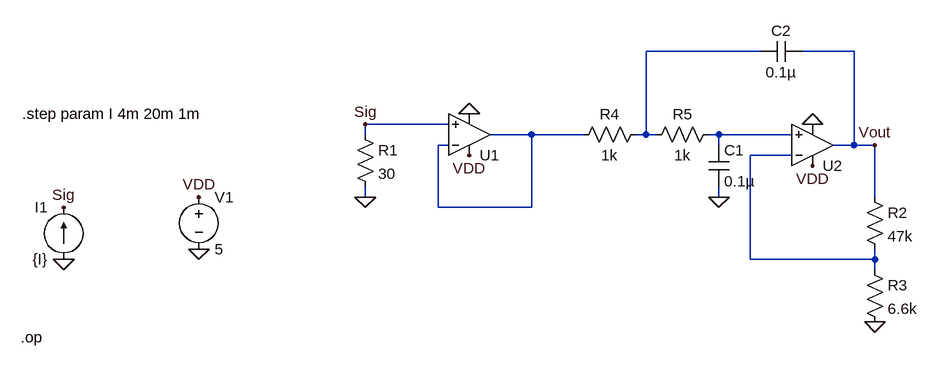
[diagram p0: schematic Pressure_Transducerasc.asc]
Pressure_Transducerasc.asc, the LTspice schematic file:
Version 4
SHEET 1 936 680
WIRE 688 -16 512 -16
WIRE 832 -16 752 -16
WIRE 208 96 80 96
WIRE 80 112 80 96
WIRE 336 112 272 112
WIRE 416 112 336 112
WIRE 512 112 512 -16
WIRE 512 112 496 112
WIRE 528 112 512 112
WIRE 624 112 608 112
WIRE 736 112 624 112
WIRE 208 128 192 128
WIRE 624 128 624 112
WIRE 832 128 832 -16
WIRE 832 128 800 128
WIRE 864 128 832 128
WIRE 736 144 672 144
WIRE 80 208 80 192
WIRE 624 208 624 192
WIRE 864 208 864 128
WIRE 192 224 192 128
WIRE 336 224 336 112
WIRE 336 224 192 224
WIRE 672 304 672 144
WIRE 864 304 864 288
WIRE 864 304 672 304
WIRE 864 320 864 304
FLAG 80 208 0
FLAG -176 288 0
FLAG -176 208 VDD
FLAG 240 144 VDD
FLAG 768 160 VDD
FLAG 240 80 0
FLAG 768 96 0
FLAG 864 400 0
FLAG 864 128 Vout
FLAG -384 304 0
FLAG -384 224 Sig
FLAG 80 96 Sig
FLAG 624 208 0
SYMBOL res 64 96 R0
SYMATTR InstName R1
SYMATTR Value 30
SYMBOL OpAmps\\UniversalOpAmp2 240 112 M180
SYMATTR InstName U1
SYMBOL OpAmps\\UniversalOpAmp2 768 128 M180
SYMATTR InstName U2
SYMBOL voltage -176 192 R0
WINDOW 123 0 0 Left 0
WINDOW 39 0 0 Left 0
SYMATTR InstName V1
SYMATTR Value 5
SYMBOL res 848 192 R0
SYMATTR InstName R2
SYMATTR Value 47k
SYMBOL res 848 304 R0
SYMATTR InstName R3
SYMATTR Value 6.6k
SYMBOL current -384 304 R180
WINDOW 0 24 80 Left 2
WINDOW 3 24 0 Left 2
WINDOW 123 0 0 Left 0
WINDOW 39 0 0 Left 0
SYMATTR InstName I1
SYMATTR Value {I}
SYMBOL res 512 96 R90
WINDOW 0 0 56 VBottom 2
WINDOW 3 32 56 VTop 2
SYMATTR InstName R4
SYMATTR Value 1k
SYMBOL res 624 96 R90
WINDOW 0 0 56 VBottom 2
WINDOW 3 32 56 VTop 2
SYMATTR InstName R5
SYMATTR Value 1k
SYMBOL cap 608 128 R0
SYMATTR InstName C1
SYMATTR Value 0.1µ
SYMBOL cap 752 -32 R90
WINDOW 0 0 32 VBottom 2
WINDOW 3 32 32 VTop 2
SYMATTR InstName C2
SYMATTR Value 0.1µ
TEXT -448 80 Left 2 !.step param I 4m 20m 1m
TEXT -450 424 Left 2 !.op

The netlist it stands for:
* Pressure_Transducerasc.asc
R1 Sig 0 30
XU1 Sig N002 VDD 0 N002 level2 Avol=1Meg GBW=10Meg Slew=10Meg Ilimit=25m Rail=0 Vos=0 En=0 Enk=0 In=0 Ink=0 Rin=500Meg  ; pins In+ In- V+ V- OUT
XU2 N003 N004 VDD 0 Vout level2 Avol=1Meg GBW=10Meg Slew=10Meg Ilimit=25m Rail=0 Vos=0 En=0 Enk=0 In=0 Ink=0 Rin=500Meg  ; pins In+ In- V+ V- OUT
V1 VDD 0 5
R2 Vout N004 47k
R3 N004 0 6.6k
I1 0 Sig {I}
R4 N001 N002 1k
R5 N003 N001 1k
C1 N003 0 0.1µ
C2 Vout N001 0.1µ
.step param I 4m 20m 1m
.op
.lib UniversalOpAmp2.lib
.backanno
.end

* Results of the author's LTspice run, read from the files saved beside the schematic
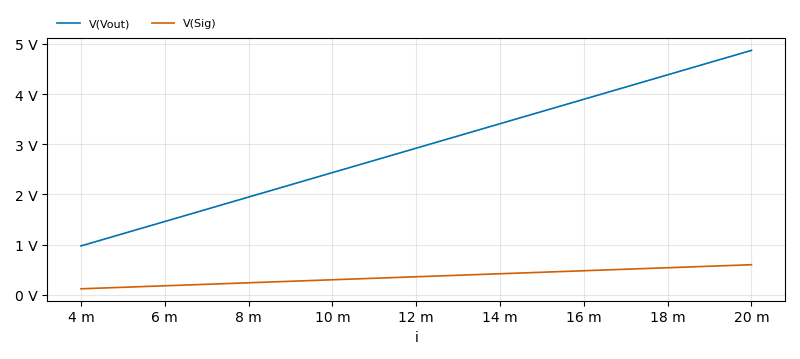
[diagram p1: Operating Point of Pressure_Transducerasc.asc, plotted from the saved traces]
* Operating Point, 1 run:
*   V(Vout): 974.4 mV at i=4 m, 4.873 V at i=20 m, min 974.4 mV, max 4.873 V
*   V(Sig): 120 mV at i=4 m, 600 mV at i=20 m, min 120 mV, max 600 mV